# EAGLE design FM-Radio_180828 (EAGLE 7.7.0)

## Sheet 1 of 2
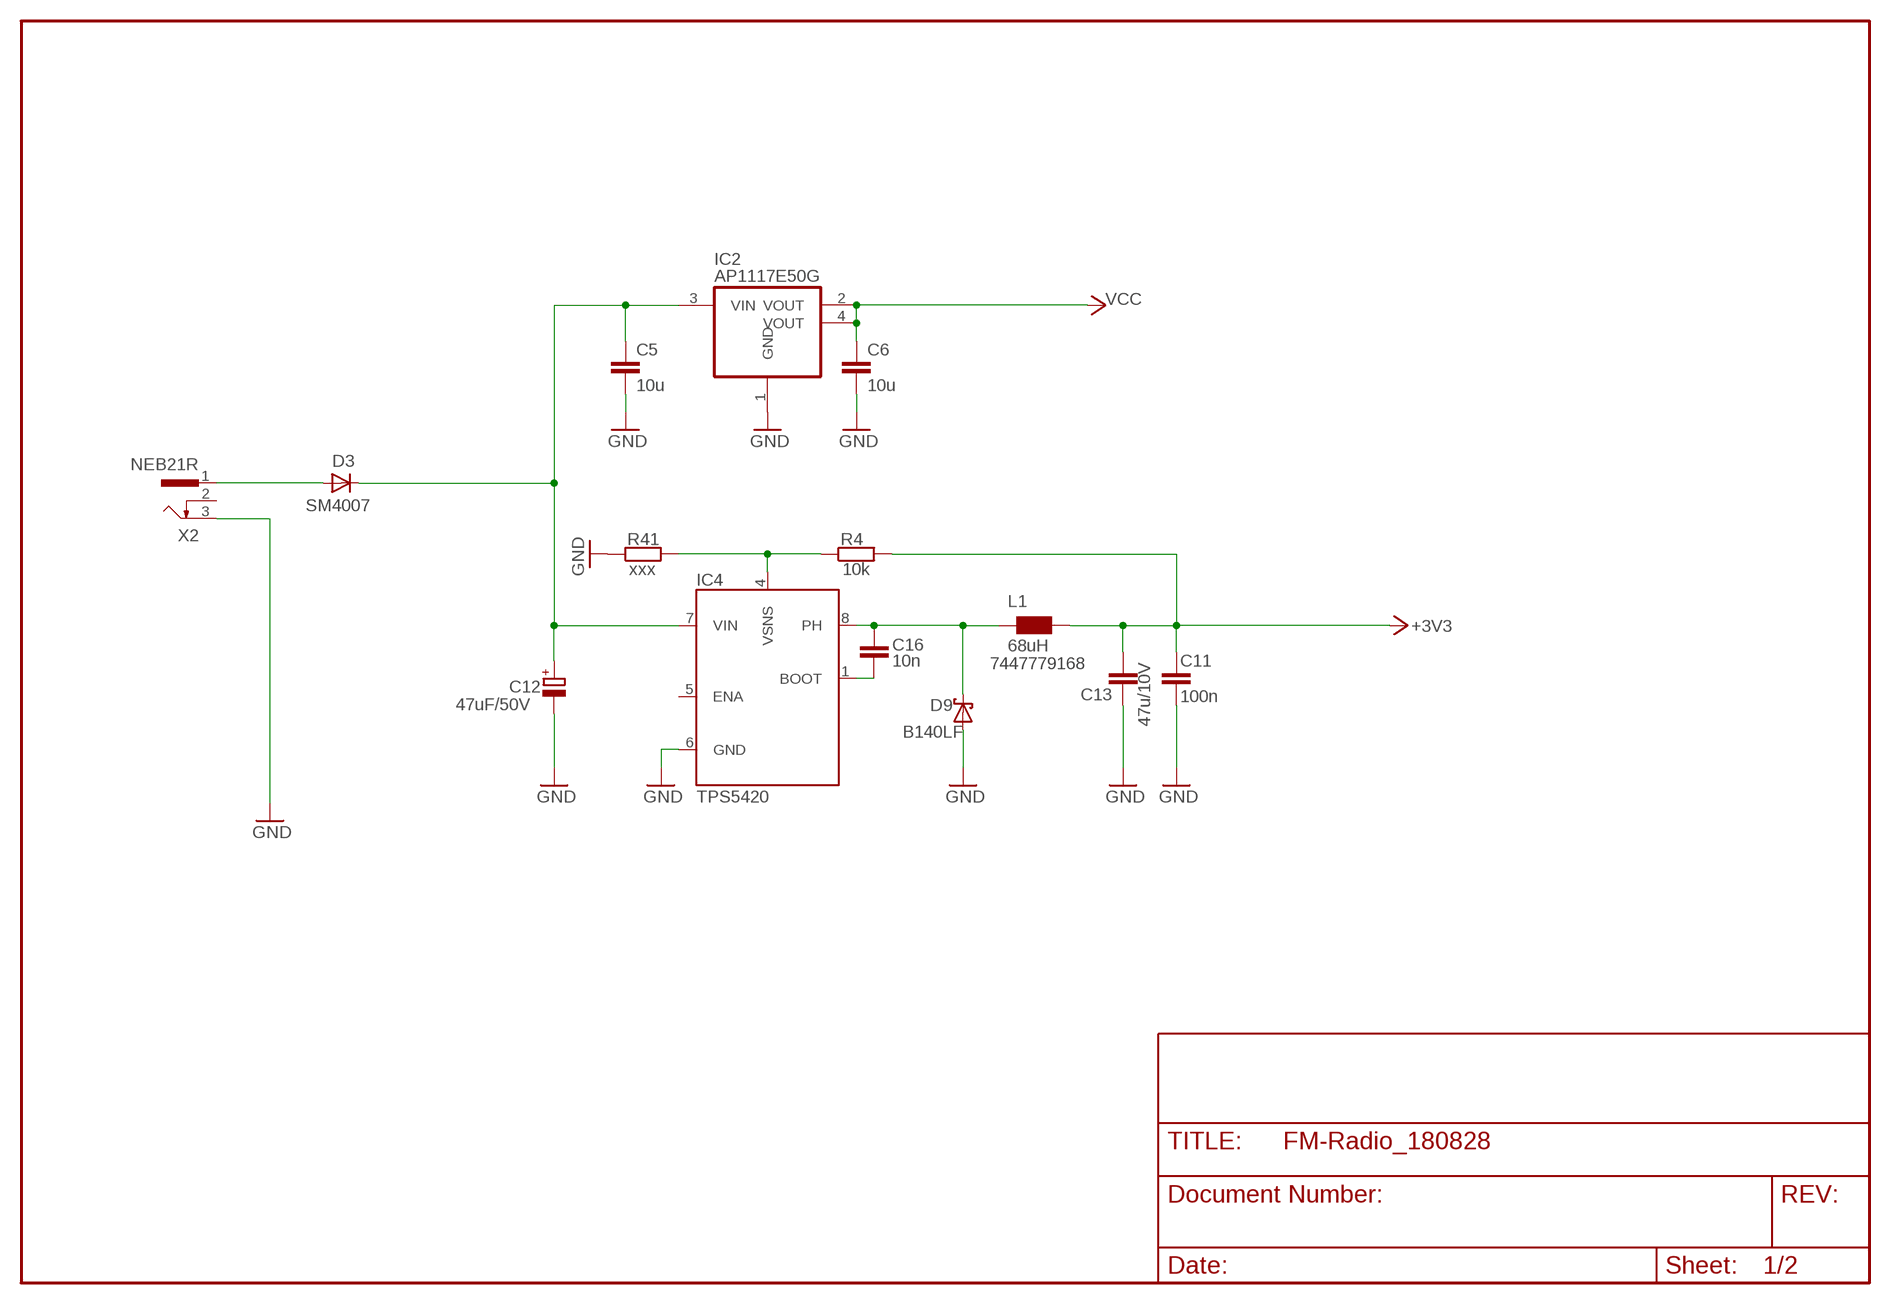
[diagram p0: schematic, sheet 1]

### Parts
C5  10u  C-EUC0805  [C0805]
C6  10u  C-EUC0805  [C0805]
C11  100n  C-EUC0805  [C0805]
C12  47uF/50V  CPOL-EUD  [PANASONIC_D]
C13  47u/10V  C-EUC1210  [C1210]
C16  10n  C-EUC0805  [C0805]
D3  SM4007  DIODE_MELF  [MELF]
D9  B140LF  SCHOTTKY_CD1607  [CD1607]
IC2  AP1117E50G  REG1117-2OUT  [SOT223]
IC4  TPS5420  TPS5410  [SO8]
L1  68uH  WE-PD_S/M  [WE-PD_S/M]
R4  10k  R-EU_R0805  [R0805]
R41  xxx  R-EU_R0805  [R0805]
X2  NEB21R  [NEB21R]

### Nets
+3V3: C11.1 C13.1 L1.1 R4.2 ; also sheet 2
+9V: C5.1 C12.+ D3.C IC2.3(VIN) IC4.7(VIN) ; also sheet 2
GND: C5.2 C6.2 C11.2 C12.- C13.2 D9.A IC2.1(GND) IC4.6(GND) R41.1 X2.3 ; also sheet 2
N$9: D3.A X2.1
N$30: IC4.4(VSNS) R4.1 R41.2
N$32: C16.1 IC4.1(BOOT)
N$33: C16.2 D9.C IC4.8(PH) L1.2
VCC: C6.1 IC2.2(VOUT) IC2.4(VOUT) ; also sheet 2
Unconnected: IC4.5(ENA) X2.2

### Notes on the sheet
- 7447779168

## Sheet 2 of 2
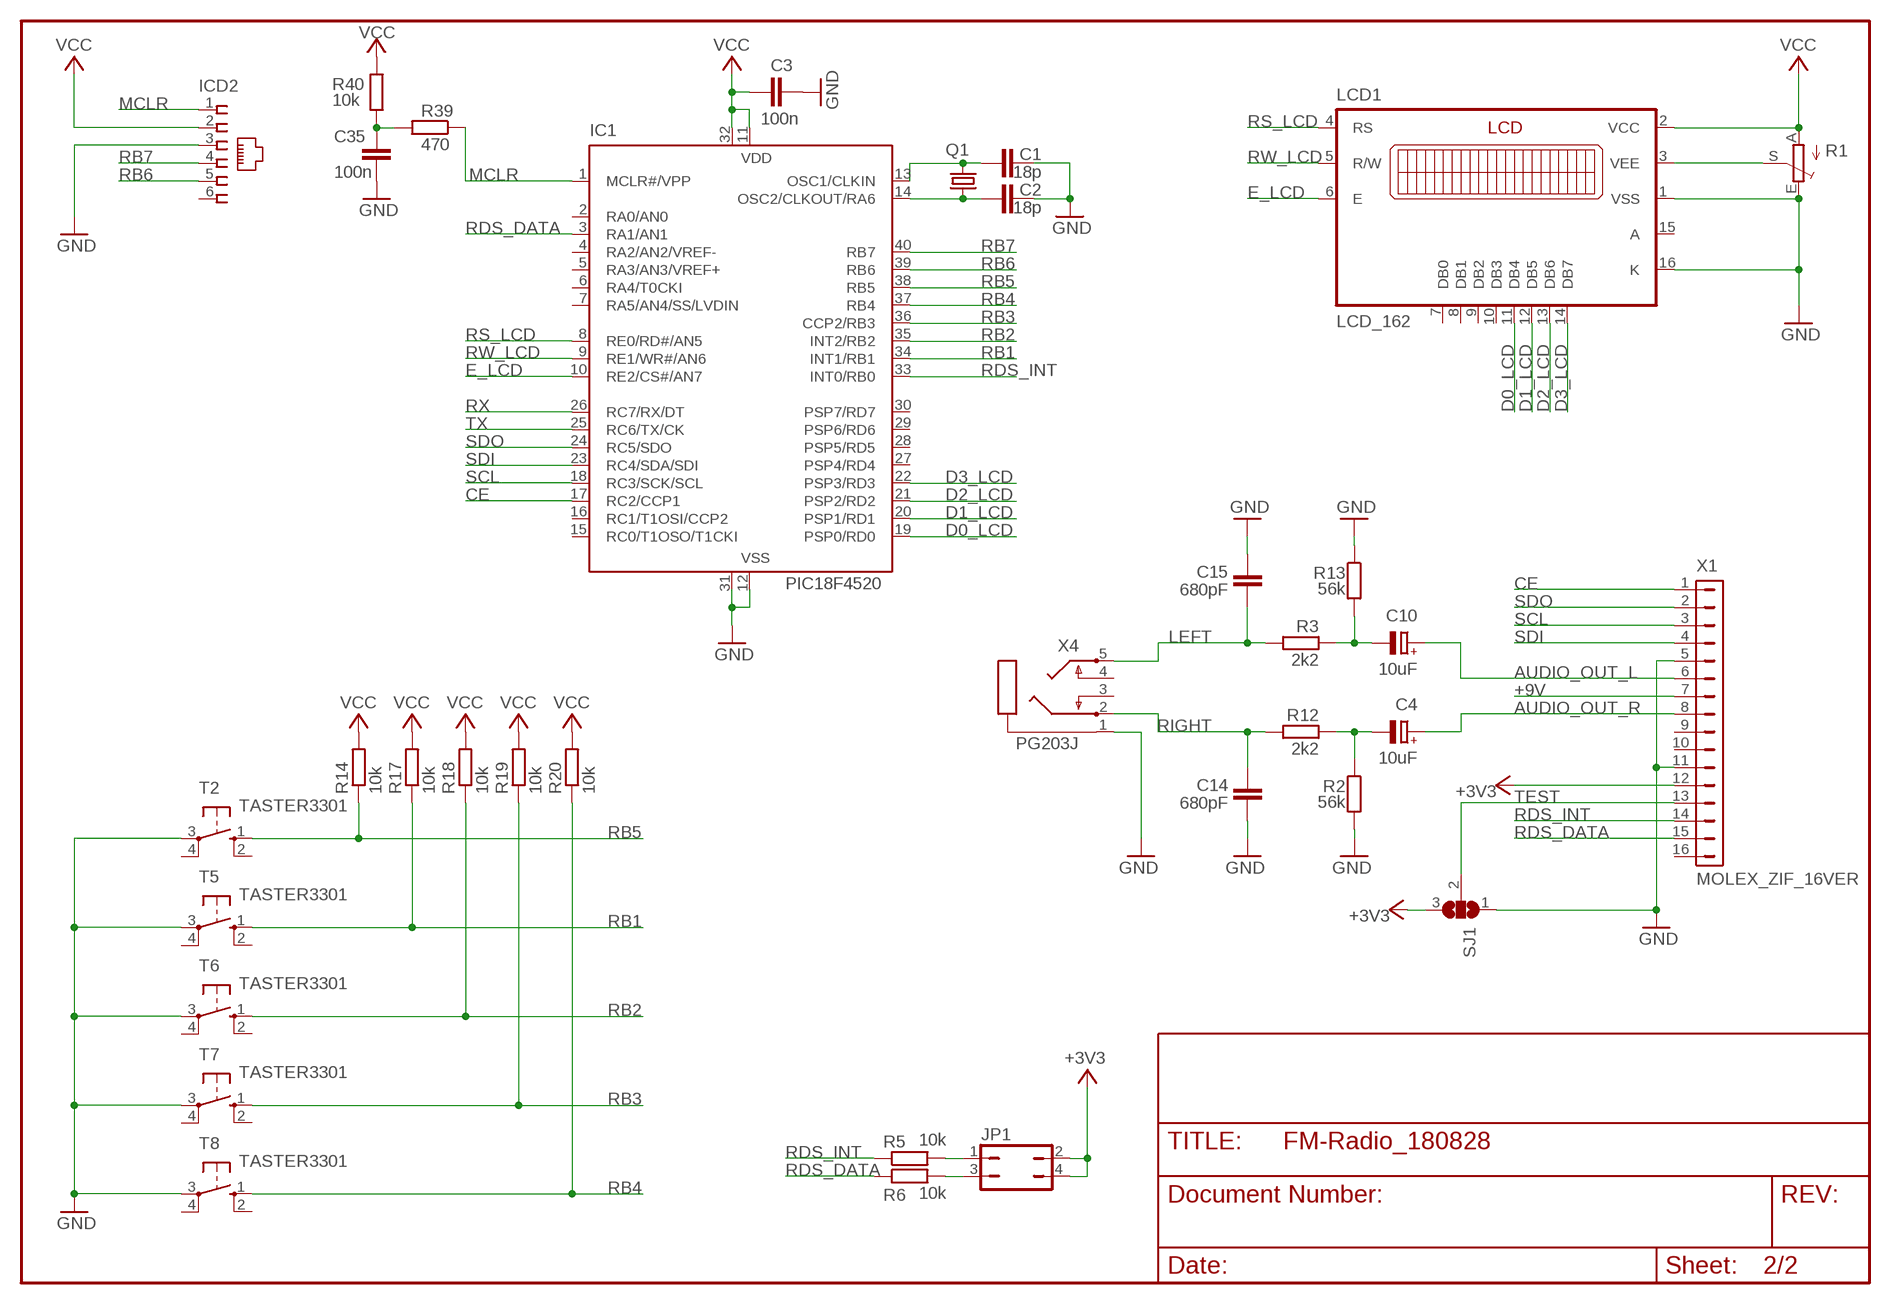
[diagram p1: schematic, sheet 2]

### Parts
C1  18p  C-EUC0805  [C0805]
C2  18p  C-EUC0805  [C0805]
C3  100n  C-EUC0805  [C0805]
C4  10uF  CPOL-EUTT2D4  [TT2D4]
C10  10uF  CPOL-EUTT2D4  [TT2D4]
C14  680pF  C-EU025-025X050  [C025-025X050]
C15  680pF  C-EU025-025X050  [C025-025X050]
C35  100n  C-EUC0805  [C0805]
IC1  PIC18F4520  PIC18C4X2  [DIL40]
ICD2  520250-3  [520250-3]
JP1  JP2Q  [JP2Q]
LCD1  LCD_162  [LCD_162]
Q1  CRYTALHC49U-V  [HC49U-V]
R1  TRIM_EU-LI10  [LI10]
R2  56k  R-EU_0207/7  [0207/7]
R3  2k2  R-EU_0207/7  [0207/7]
R5  10k  R-EU_M0805  [M0805]
R6  10k  R-EU_M0805  [M0805]
R12  2k2  R-EU_0207/7  [0207/7]
R13  56k  R-EU_0207/7  [0207/7]
R14  10k  R-EU_0207/7  [0207/7]
R17  10k  R-EU_0207/7  [0207/7]
R18  10k  R-EU_0207/7  [0207/7]
R19  10k  R-EU_0207/7  [0207/7]
R20  10k  R-EU_0207/7  [0207/7]
R39  470  R-EU_M0805  [M0805]
R40  10k  R-EU_M0805  [M0805]
SJ1  SJ2W  [SJ_2]
T2  TASTER3301  [TASTER3301]
T5  TASTER3301  [TASTER3301]
T6  TASTER3301  [TASTER3301]
T7  TASTER3301  [TASTER3301]
T8  TASTER3301  [TASTER3301]
X1  MOLEX_ZIF_16VER  [ZIF_16POL]
X4  PG203J  [PG203J]

### Nets
+3V3: JP1.2 JP1.4 SJ1.3 X1.12 ; also sheet 1
+9V: X1.7 ; also sheet 1
AUDIO_OUT_L: C10.+ X1.6
AUDIO_OUT_R: C4.+ X1.8
CE: IC1.17(RC2/CCP1) X1.1
D0_LCD: IC1.19(PSP0/RD0) LCD1.11(DB4)
D1_LCD: IC1.20(PSP1/RD1) LCD1.12(DB5)
D2_LCD: IC1.21(PSP2/RD2) LCD1.13(DB6)
D3_LCD: IC1.22(PSP3/RD3) LCD1.14(DB7)
E_LCD: IC1.10(RE2/CS#/AN7) LCD1.6(E)
GND: C1.2 C2.2 C3.2 C14.1 C15.2 C35.2 IC1.12(VSS) IC1.31(VSS) ICD2.3 LCD1.1(VSS) LCD1.16(K) R1.E R2.2 R13.1 SJ1.1 T2.3(P) T5.3(P) T6.3(P) T7.3(P) T8.3(P) X1.5 X1.11 X4.1 ; also sheet 1
LEFT: C15.1 R3.1 X4.5
MCLR: IC1.1(MCLR#/VPP) ICD2.1 R39.1
N$1: C10.- R3.2 R13.2
N$2: JP1.1 R5.2
N$3: JP1.3 R6.2
N$4: C2.1 IC1.14(OSC2/CLKOUT/RA6) Q1.1
N$5: C1.1 IC1.13(OSC1/CLKIN) Q1.2
N$6: LCD1.3(VEE) R1.S
N$7: C4.- R2.1 R12.2
N$47: C35.1 R39.2 R40.2
RB1: IC1.34(INT1/RB1) R17.1 T5.1(S)
RB2: IC1.35(INT2/RB2) R18.1 T6.1(S)
RB3: IC1.36(CCP2/RB3) R19.1 T7.1(S)
RB4: IC1.37(RB4) R20.1 T8.1(S)
RB5: IC1.38(RB5) R14.1 T2.1(S)
RB6: IC1.39(RB6) ICD2.5
RB7: IC1.40(RB7) ICD2.4
RDS_DATA: IC1.3(RA1/AN1) R6.1 X1.15
RDS_INT: IC1.33(INT0/RB0) R5.1 X1.14
RIGHT: C14.2 R12.1 X4.2
RS_LCD: IC1.8(RE0/RD#/AN5) LCD1.4(RS)
RW_LCD: IC1.9(RE1/WR#/AN6) LCD1.5(R/W)
RX: IC1.26(RC7/RX/DT)
SCL: IC1.18(RC3/SCK/SCL) X1.3
SDI: IC1.23(RC4/SDA/SDI) X1.4
SDO: IC1.24(RC5/SDO) X1.2
TEST: SJ1.2 X1.13
TX: IC1.25(RC6/TX/CK)
VCC: C3.1 IC1.11(VDD) IC1.32(VDD) ICD2.2 LCD1.2(VCC) R1.A R14.2 R17.2 R18.2 R19.2 R20.2 R40.1 ; also sheet 1
Unconnected: IC1.2(RA0/AN0) IC1.4(RA2/AN2/VREF-) IC1.5(RA3/AN3/VREF+) IC1.6(RA4/T0CKI) IC1.7(RA5/AN4/SS/LVDIN) IC1.15(RC0/T1OSO/T1CKI) IC1.16(RC1/T1OSI/CCP2) IC1.27(PSP4/RD4) IC1.28(PSP5/RD5) IC1.29(PSP6/RD6) IC1.30(PSP7/RD7) ICD2.6 LCD1.7(DB0) LCD1.8(DB1) LCD1.9(DB2) LCD1.10(DB3) LCD1.15(A) T2.2(S1) T2.4(P1) T5.2(S1) T5.4(P1) T6.2(S1) T6.4(P1) T7.2(S1) T7.4(P1) T8.2(S1) T8.4(P1) X1.9 X1.10 X1.16 X4.3 X4.4

## Library data of the parts
C1-C3 C5 C6 C13-C15 C35 = rcl:C-EU: CAPACITOR, European symbol
C4 C10 = rcl:CPOL-EU: POLARIZED CAPACITOR, European symbol
C11 C16 = rcl_416:C-EU: CAPACITOR, European symbol
C12 = rcl_416:CPOL-EU: POLARIZED CAPACITOR, European symbol
D3 = Bernd:DIODE
D9 = Bernd:SCHOTTKY
IC1 = Bernd:PIC18C4X2
IC2 = Bernd_110428:REG1117-2OUT: 800mA and 1A Low Dropout (LDO) Positive Regulator 1.8V, 2.5V, 2.85V, 3.3V, 5V, and Adj
IC4 = Bernd:TPS5410
ICD2 = con-amp:520250-3: AMP connector
JP1 = jumper:JP2Q: JUMPER
L1 = wuerth-elektronik:WE-PD: SMD-Shielded Power Inductors WE-PD Is recommended for the application with switching regulators from National Semiconductor, Linear Technology, Texas Instruments and Fairchild Semiconductor - Magnetically shielded version which results in a low leakage field - High storage capacity - Low self-losses -- Switching regulators with low operating voltages (computer, laptop, mobile phones, pagers) -- Integrated DC/DC-converter
LCD1 = Bernd:LCD_162
Q1 = crystal:CRYTAL: CRYSTAL
R1 = pot:TRIM_EU-: POTENTIOMETER
R2-R4 R12-R14 R17-R20 R39-R41 = rcl:R-EU_: RESISTOR, European symbol
R5 R6 = rcl_416:R-EU_: RESISTOR, European symbol
SJ1 = jumper:SJ2W: SMD solder JUMPER
T2 T5-T8 = Bernd:TASTER3301
X1 = Bernd:MOLEX_ZIF_16
X2 = con-lumberg:NEB21R: Netzgeräte-Einbaukupplung abgewinkelte Ausführung mit Öffner Source: http://www.lumberg.com/Produkte/PDFs/NEB21R.pdf; FARNELL: 1217037; MPN: NEB 21 R; OC_FARNELL: 1217037; OC_NEWARK: 97K6458
X4 = con-hirschmann:PG203J: MIC/HEADPHONE JACK KS-S stereo microphone/headphone jack PG203JN (Schukat)

## Board
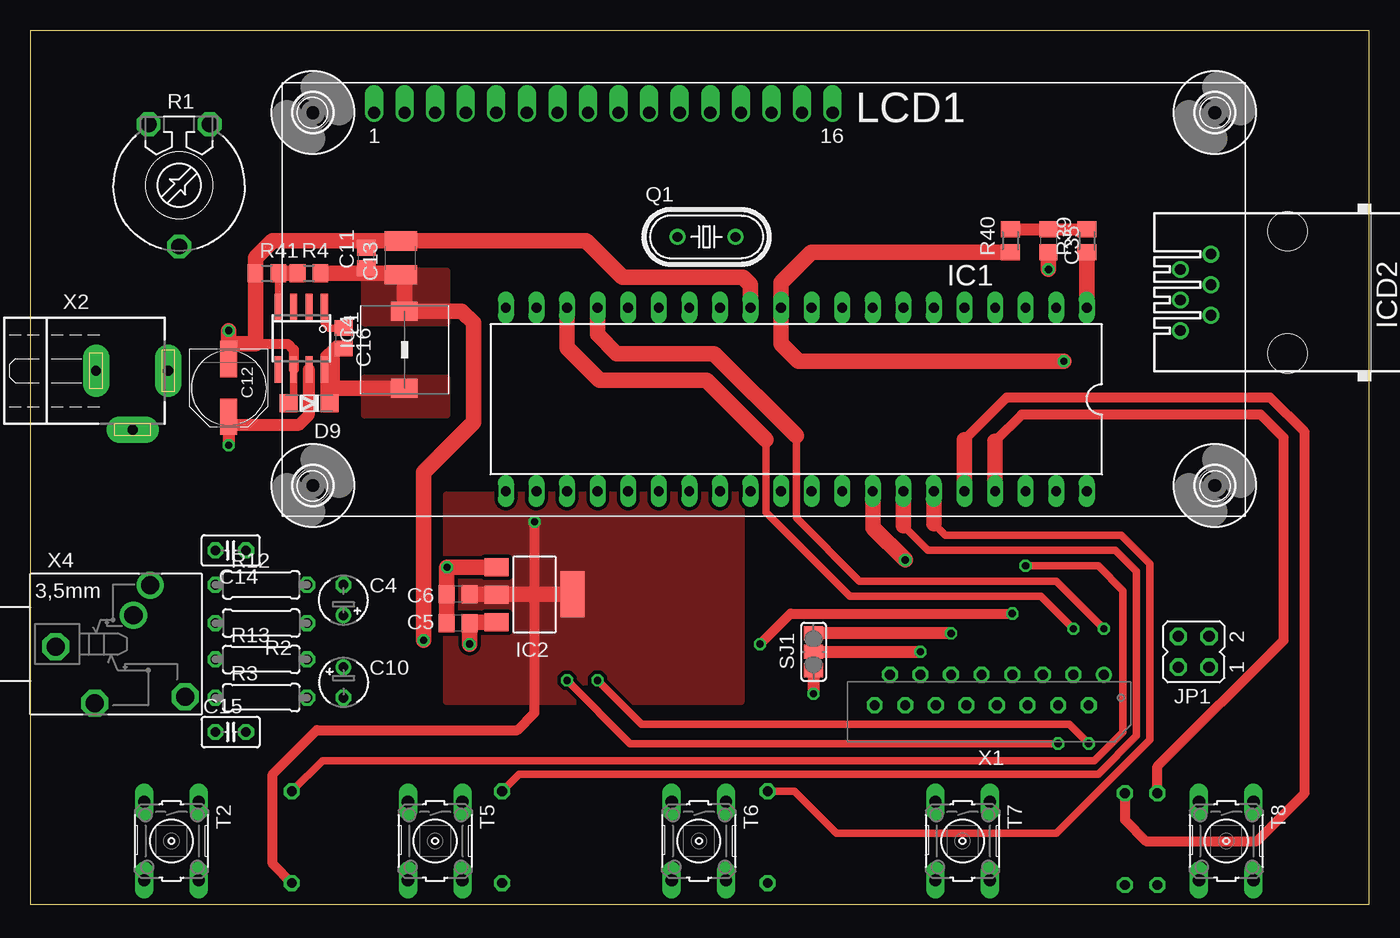
[diagram p2: board, top side]
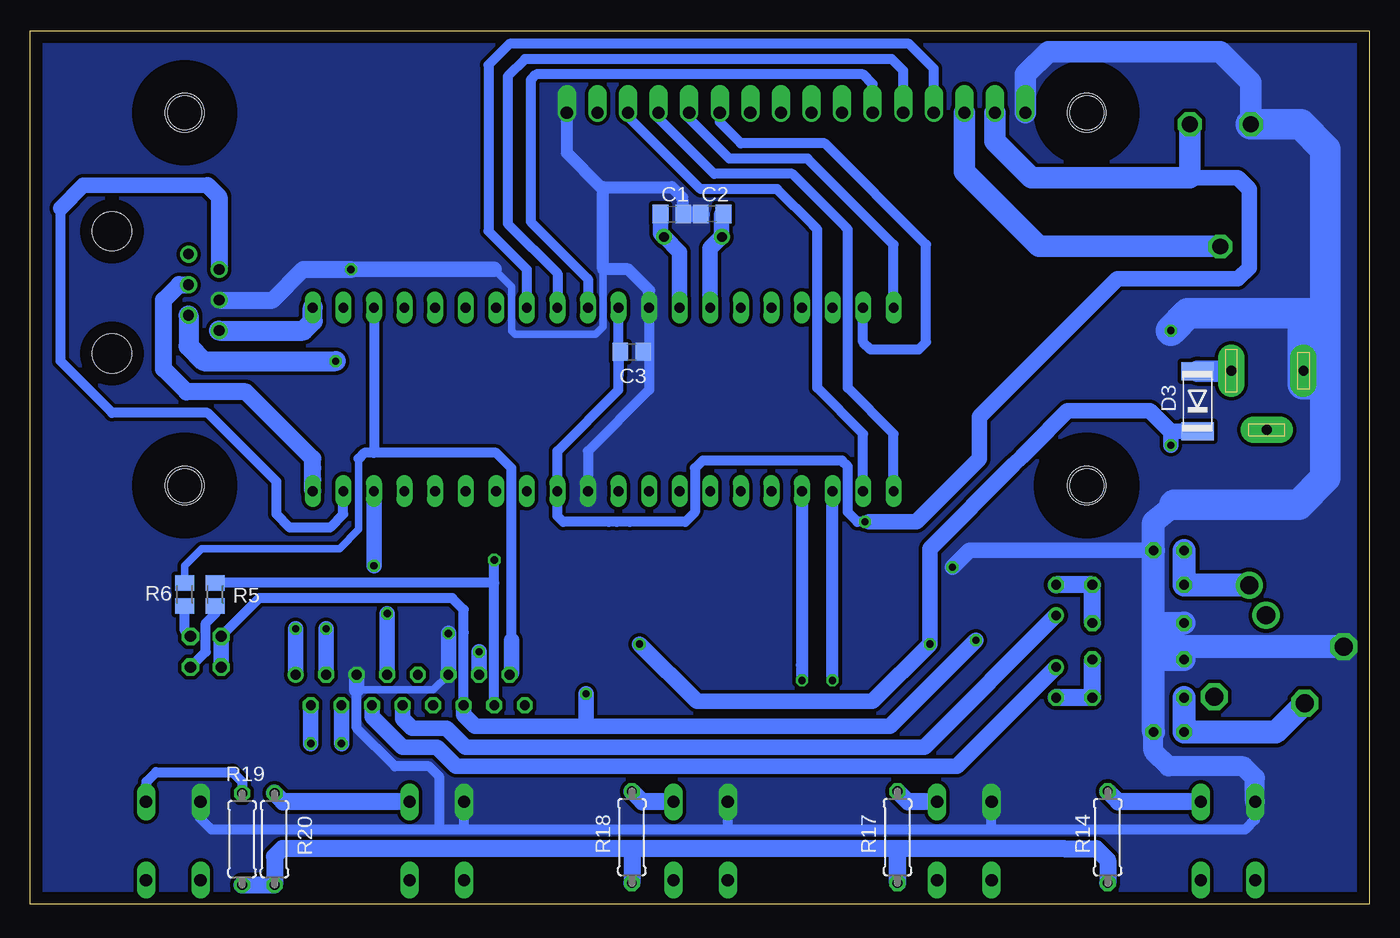
[diagram p3: board, bottom side, seen from below]

Size 111.26 x 72.54 mm. Coordinates in mm from the lower left corner, seen from the top.
Outline: 0,0 111.26,0 111.26,72.54 0,72.54 0,0
Copper layers (1*16): Top 0.035mm / dielectric 1.5mm / Bottom 0.035mm
Design rules "default": minimum track width 10mil, minimum drill 24mil, track to track 8mil, track to pad 8mil, pad to pad 8mil, via to via 8mil, smd to smd 8mil, copper to edge 40mil, drill to drill 8mil, minimum pad ring 10mil, minimum via ring 8mil, stop-mask expansion 4mil, vias tented up to drill 0mil, thermal gap 10mil

### Footprints (pad centres in the part's own frame; a part is rotated, then mirrored left to right if it is on the bottom)
C0805 = smd 1.3 x 1.5: 1 -0.95,0; 2 0.95,0
TT2D4 = drill 0.813: + -1.27,0 | drill 0.813 octagon: - 1.27,0
C0805' = smd 1.3 x 1.5: 1 -0.85,0; 2 0.85,0
PANASONIC_D = smd 3 x 1.4: + 2.4,0; - -2.4,0
C1210 = smd 1.6 x 2.7: 1 -1.4,0; 2 1.4,0
C025-025X050 = drill 0.813 octagon: 1 -1.27,0; 2 1.27,0
MELF = smd 1.5 x 2.7: A 2.5,0; C -2.5,0
CD1607 = smd 1.5 x 1.5: A 1.7,0; C -1.7,0
DIL40 = drill 0.813 long: 1 -24.13,-7.62; 2 -21.59,-7.62; 3 -19.05,-7.62; 4 -16.51,-7.62; 5 -13.97,-7.62; 6 -11.43,-7.62; 7 -8.89,-7.62; 8 -6.35,-7.62; 9 -3.81,-7.62; 10 -1.27,-7.62; 11 1.27,-7.62; 12 3.81,-7.62; 13 6.35,-7.62; 14 8.89,-7.62; 15 11.43,-7.62; 16 13.97,-7.62; 17 16.51,-7.62; 18 19.05,-7.62; 19 21.59,-7.62; 20 24.13,-7.62; 21 24.13,7.62; 22 21.59,7.62; 23 19.05,7.62; 24 16.51,7.62; 25 13.97,7.62; 26 11.43,7.62; 27 8.89,7.62; 28 6.35,7.62; 29 3.81,7.62; 30 1.27,7.62; 31 -1.27,7.62; 32 -3.81,7.62; 33 -6.35,7.62; 34 -8.89,7.62; 35 -11.43,7.62; 36 -13.97,7.62; 37 -16.51,7.62; 38 -19.05,7.62; 39 -21.59,7.62; 40 -24.13,7.62
SOT223 = smd 1.499 x 2.007: 1 -2.261,-3.15; 2 0.025,-3.15; 3 2.311,-3.15 | smd 3.81 x 2.007: 4 0,3.15
SO8 = smd 0.6 x 2.2: 1 -1.905,-2.6; 2 -0.635,-2.6; 3 0.635,-2.6; 4 1.905,-2.6; 5 1.905,2.6; 6 0.635,2.6; 7 -0.635,2.6; 8 -1.905,2.6
520250-3 = drill 0.889: 1 -3.175,8.89; 2 -1.905,6.35; 3 -0.635,8.89; 4 0.635,6.35; 5 1.905,8.89; 6 3.175,6.35 | hole 3.251: -5.08,0; 5.08,0
JP2Q = drill 0.914 octagon: 1 -1.27,-1.27; 2 -1.27,1.27; 3 1.27,-1.27; 4 1.27,1.27
WE-PD_S/M = smd 1.6 x 2.2: 1 -3.2,0; 2 3.2,0
LCD_162 = drill 1.016 offset: 1 -31.75,15.24; 2 -29.21,15.24; 3 -26.67,15.24; 4 -24.13,15.24; 5 -21.59,15.24; 6 -19.05,15.24; 7 -16.51,15.24; 8 -13.97,15.24; 9 -11.43,15.24; 10 -8.89,15.24; 11 -6.35,15.24; 12 -3.81,15.24; 13 -1.27,15.24; 14 1.27,15.24; 15 3.81,15.24; 16 6.35,15.24 | hole 2.8: -36.83,15.24; 38.1,15.24; 38.1,-15.748; -36.83,-15.748
HC49U-V = drill 0.813: 1 -2.413,0; 2 2.413,0
LI10 = drill 1.321 octagon: A -2.54,-5.08; E 2.54,-5.08; S 0,5.08
0207/7 = drill 0.813 octagon: 1 -3.81,0; 2 3.81,0
R0805 = smd 1.3 x 1.5: 1 -0.95,0; 2 0.95,0
M0805 = smd 1.3 x 1.6: 1 -0.95,0; 2 0.95,0
SJ_2 = smd 1.168 x 1.6: 1 -1.524,0; 2 0,0; 3 1.524,0
TASTER3301 = drill 1.016 long: 1 -3.251,2.261; 2 3.251,2.261; 3 -3.251,-2.261; 4 3.251,-2.261
3,2 = hole 3.2: 0,0
ZIF_16POL = drill 0.813: 1 0,0 | drill 0.813 octagon: 2 1.27,2.54; 3 2.54,0; 4 3.81,2.54; 5 5.08,0; 6 6.35,2.54; 7 7.62,0; 8 8.89,2.54; 9 10.16,0; 10 11.43,2.54; 11 12.7,0; 12 13.97,2.54; 13 15.24,0; 14 16.51,2.54; 15 17.78,0; 16 19.05,2.54
NEB21R = drill 0.813 pad 2.184 long: 1 0,7.35; 2 4.9,4.4; 3 0,1.35
PG203J = drill 1.499 octagon: 1 -5.004,-0.203; 4 5.74,-4.369; 5 -1.753,-4.902 | drill 1.499: 2 2.845,4.902; 3 1.448,2.388

### Placement (x,y rotation side)
C1  57.94,57.3 0 bottom
C2  54.61,57.3 180 bottom
C3  61.27,45.87 0 bottom
C4  26.03,25.24 90 top
C5  35.55,23.33 180 top
C6  35.55,25.71 180 top
C10  26.03,18.41 270 top
C11  100n  [C0805']  27.94,53.65 90 top
C12  16.51,42.86 270 top
C13  30.79,53.65 90 top
C14  16.66,29.36 180 top
C15  16.66,14.28 0 top
C16  10n  [C0805']  26.03,46.98 270 top
C35  84.61,55.08 270 top
D3  14.28,41.75 90 bottom
D9  23.17,41.59 180 top
IC1  63.65,41.9 180 top
IC2  41.9,25.71 270 top
IC4  22.54,46.98 180 top
ICD2  104.45,50.79 90 top
JP1  96.67,20.95 90 top
L1  31.11,46.03 270 top
LCD1  60.32,50.48 0 top
Q1  56.19,55.4 0 top
R1  12.38,59.68 180 top
R2  19.2,23.33 180 top
R3  19.2,17.14 0 top
R4  23.17,52.38 0 top
R5  95.88,25.71 270 bottom
R6  98.42,25.71 270 bottom
R12  19.2,26.5 0 top
R13  19.2,20.31 0 top
R14  21.74,5.55 270 bottom
R17  39.21,5.55 270 bottom
R18  61.27,5.55 270 bottom
R19  90.96,5.39 270 bottom
R20  93.66,5.39 270 bottom
R39  87.78,55.08 90 top
R40  81.43,55.08 90 top
R41  19.68,52.38 0 top
SJ1  65.08,20.95 270 top
T2  11.74,5.23 270 top
T5  33.65,5.23 270 top
T6  55.56,5.23 270 top
T7  77.47,5.23 270 top
T8  99.37,5.23 270 top
U$3  [3,2]  23.49,65.72 0 top
U$4  [3,2]  98.42,65.72 0 top
U$5  [3,2]  98.42,34.76 0 top
U$7  [3,2]  23.49,34.76 0 top
X1  89.21,19.04 180 top
X2  4.12,44.29 270 top
X4  7.14,21.58 0 top

### Tracks (layer width: path | path; a pad name or v marks a point on that pad's centre or on a via)
+3V3  (via drill 0.6)
  Top 1.016: SJ1.3 v65.08,17.46
  Top 1.27: R4.2 27.94,52.38 | 27.94,52.38 31.11,52.38 31.11,51.93 | 31.11,51.93 L1.1 35.85,49.23 36.82,48.25 36.82,40 32.7,35.87 v32.7,21.9 | C13.1 31.11,51.93 | C11.1 27.94,52.38
  Bottom 0.813: X1.12 75.24,22.54 75.24,24.44 76.2,25.39 77.15,25.39 92.23,25.39 94.77,22.85 JP1.4 | JP1.4 | X1.12 | X1.12
  Bottom 1.27: JP1.4 JP1.2 | v32.7,21.9 39.84,14.76 65.08,14.76 | 65.08,14.76 74.29,14.76 75.24,15.71 X1.12 | v65.08,17.46 65.08,14.76
  pour Top (isolate 0.406, no thermals): 27.78,52.54 34.6,52.54 34.6,48.25 27.78,48.25
+9V  (via drill 0.6)
  Top 0.813: v81.59,24.12 63.18,24.12 v60.64,21.58
  Top 1.016: 16.51,39.82 22.36,39.82 23.17,40.63 IC4.7 | C12.+ 16.51,39.82 | 16.51,39.82 16.51,38.25 v16.51,38.09
  Top 1.27: IC2.3 36.5,23.4 C5.1 v36.5,21.59 v36.51,21.58
  Bottom 1.27: 20.47,40.95 18.25,40.95 | 18.25,40.95 25.08,40.95 28.25,37.78 28.89,37.14 29.52,36.51 36.51,29.52 v36.51,21.58 41.27,16.82 55.88,16.82 v60.64,21.58 | X1.7 81.59,21.74 v81.59,24.12 | D3.C 16.51,39.24 | 16.51,39.24 16.55,39.24 18.25,40.95 | v16.51,38.09 16.51,39.24
AUDIO_OUT_L
  Bottom 1.27: X1.6 82.86,15.55 80.32,13.01 77.47,13.01 75.88,11.42 34.28,11.42 C10.+ | C10.+
AUDIO_OUT_R
  Bottom 1.27: X1.8 80.32,15.39 79.53,14.6 76.67,14.6 75.08,13.01 36.98,13.01 C4.+
CE  (via drill 0.6)
  Top 0.61: v89.21,22.85 88.58,23.49 85.24,26.82 68.89,26.82 63.65,32.06 63.65,38.89
  Top 0.813: IC1.17
  Top 1.27: 63.65,38.89 56.83,45.71 48.73,45.71 47.14,47.3 IC1.17
  Bottom 1.27: X1.1 89.21,21.27 v89.21,22.85
D0_LCD
  Bottom 0.813: LCD1.11 53.97,64.92 52.22,63.18 45.24,63.18 36.82,54.76 36.82,46.67 37.46,46.03 41.43,46.03 42.06,46.67 IC1.19 | IC1.19
D1_LCD
  Bottom 0.813: LCD1.12 56.51,65.24 53.18,61.91 46.67,61.91 39.52,54.76 39.52,49.84 | 39.52,49.84 | IC1.20 39.52,49.84
D2_LCD
  Bottom 0.813: LCD1.13 59.05,65.24 54.45,60.64 47.94,60.64 43.49,56.19 | 43.49,56.19 | 43.49,56.19 43.33,56.03 43.33,42.86 39.52,39.05 IC1.21 | IC1.21
D3_LCD
  Bottom 0.813: LCD1.14 61.59,65.4 55.56,59.37 49.21,59.37 46.19,56.35 | 46.19,56.35 | 46.03,56.19 46.19,56.35 | 46.03,56.19 | 46.03,56.19 45.87,56.03 45.87,42.86 42.06,39.05 IC1.22 | IC1.22
E_LCD
  Bottom 0.813: LCD1.6 41.27,68.1 42.06,68.89 69.21,68.89 69.69,68.41 69.69,56.67 65.08,52.06 | 65.08,52.06 | 65.08,52.06 64.92,51.9 64.92,49.68 | 64.92,49.68 | 64.92,49.68 IC1.10
GND  (via drill 0.6)
  Top 0.61: IC4.6 21.9,41.59 D9.A
  Top 0.813: IC4.6 21.9,46.03 21.43,46.51 16.51,46.51 C12.-
  Top 1.016: v76.51,22.47 SJ1.1
  Top 1.27: 59.84,51.43 59.21,52.06 49.21,52.06 46.19,55.08 30.79,55.08 | 27.94,55.08 20.16,55.08 18.73,53.65 R41.1 18.73,46.51 16.66,46.51 | 27.94,55.08 30.79,55.08 | C35.2 v84.61,52.7 | C5.2 C6.2 34.6,27.94 v34.64,27.97 IC2.1 | 16.51,46.51 v16.51,47.62 | C11.2 27.94,55.08 | C13.2 30.79,55.08 | 59.84,51.43 | 59.84,51.43 IC1.12
  Bottom 0.61: 72.7,52.7 71.27,51.27 71.27,47.62 70.96,47.3 64.29,47.3 63.65,47.94 63.65,52.7 | X1.11 77.78,17.77 84.13,17.77
  Bottom 0.813: IC1.12 | 60.48,45.87 C3.2 59.84,45.87 | 59.84,45.87 59.84,42.7 64.92,37.62 64.92,34.44 | 64.92,34.44 | 64.92,34.44 IC1.31 | LCD1.16 | LCD1.16 | 31.43,6.18 10.31,6.18 9.52,6.98 9.52,8.41 9.48,8.45 T2.3 | 31.43,6.18 53.34,6.18 | 53.34,6.18 75.24,6.18 | 75.24,6.18 77.31,6.18 | 77.31,6.18 96.2,6.18 97.15,7.14 97.15,8.57 97.11,8.53 T8.3 | T5.3 31.39,6.22 31.43,6.18 | T6.3 53.3,6.22 53.34,6.18 | 75.24,6.18 75.2,6.22 T7.3 75.24,8.52 75.24,8.57 | X1.11 | X1.5 | X1.5 | 84.13,17.77 84.13,14.6 80.96,11.42 78.1,11.42 77.31,10.63 77.31,6.18 | IC1.12 59.84,45.87
  Bottom 1.016: IC1.12 59.84,50.95 61.59,52.7 63.65,52.7 63.65,52.86 63.65,59.52 63.81,59.52 | 63.81,59.52 66.67,62.38 LCD1.16 | C1.2 57.09,58.67 57.94,59.52 63.81,59.52
  Bottom 1.27: C2.2 55.45,57.3 C1.2 | 72.7,52.7 v84.61,52.7 87.94,52.7 | C14.1 33.25,29.36 v34.64,27.97 | 84.13,17.77 X1.5 | X1.11 v76.51,22.47
  Bottom 1.422: 18.25,29.36 | C14.1 18.25,29.36 | ICD2.3 91.12,50.16 88.58,52.7 v84.61,52.7
  Bottom 1.676: C15.2 17.93,12.69 16.66,11.42 10.47,11.42 9.52,10.47 9.52,8.57 9.48,8.53 T2.3
  Bottom 1.778: LCD1.1 28.57,68.89 26.67,70.8 17.78,70.8 12.38,70.8 9.84,68.26 R1.E
  Bottom 1.93: C15.2 | C15.2 17.93,20.31 | 17.93,20.31 17.93,23.33 | 17.93,23.33 C14.1 | C14.1 | R2.2 | 17.93,23.33 R2.2 | R13.1 | 17.93,20.31 R13.1 | X4.1 2.18,21.42 17.3,21.42 16.51,20.63 15.55,20.63 15.55,20.47 R13.1 | C14.1 17.93,31.74 16.19,33.17
  Bottom 2.54: 7.93,49.05 10.47,49.05 | 16.19,33.17 5.87,33.17 3.65,35.39 3.65,44.28 | 3.65,49.05 3.65,62.7 5.71,64.76 R1.E | 5.55,49.05 7.93,49.05 | v16.51,47.62 15.08,49.05 12.22,49.05 7.93,49.05 | 4.28,49.05 | 3.65,49.05 4.28,49.05 | 3.65,44.28 X2.3 | 3.65,44.28 3.65,49.05 | 4.28,49.05 5.55,49.05 | 5.55,49.05 5.55,43.17 3.96,43.17 3.96,45.71
  pour Bottom (isolate 0.305, no thermals): -0.01,-0.01 111.12,-0.01 111.12,72.38 -0.01,72.38
LEFT
  Bottom 1.93: X4.5 7.79,14.28 C15.1 | C15.1 | C15.1 | R3.1 | C15.1 R3.1
MCLR
  Top 1.016: IC1.1
  Top 1.27: IC1.1 R39.1
  Bottom 1.676: ICD2.1 88.58,47.62 87.78,48.41 IC1.1
N$1
  Bottom 1.422: R3.2 R13.2 | R3.2 | R3.2 | R3.2 C10.- | R3.2
N$2
  Bottom 0.813: R5.2 95.88,24.12 96.67,23.33 96.67,20.95 JP1.1 | JP1.1
N$3
  Bottom 0.813: JP1.3 | R6.2 98.42,22.69 JP1.3
N$4
  Bottom 1.27: C2.1 53.81,57.25 53.81,55.4 | 53.81,55.4 Q1.1 | IC1.14 54.76,54.44 53.81,55.4
N$5
  Bottom 1.27: C1.1 58.89,57.2 58.89,55.68 Q1.2 58.57,55.4 57.3,54.13 IC1.13
N$6
  Bottom 1.778: LCD1.3 33.65,60.79 27.46,54.6 13.33,54.6 R1.S | R1.S
N$7
  Bottom 1.422: R12.2 | R2.1 R12.2 | C4.- | R12.2 C4.- | C4.-
N$9
  Bottom 1.778: D3.A 11.51,44.24 X2.1
N$30
  Top 0.61: IC4.4 20.63,52.7 R41.2
  Top 1.27: R41.2 R4.1
N$32
  Top 0.61: IC4.1 24.44,48.25 24.86,47.83 C16.1
N$33
  Top 0.61: D9.C 24.44,41.59 IC4.8 24.44,45.55 25.08,46.19 25.97,46.19 C16.2
  Top 1.27: L1.2 25.08,42.83 25.08,43.81 | 25.08,43.81 25.08,45.71 25.5,46.13 C16.2 | 25.08,43.81 24.92,43.65 24.92,41.74
  pour Top (isolate 0.406, no thermals): 27.78,43.65 34.6,43.65 34.6,40.63 27.78,40.63
N$47
  Top 1.016: R40.2 C35.1 R39.2
RB1
  Top 0.61: 72.54,31.43 74.61,29.36 90.17,29.36 91.91,27.62 91.91,26.5 91.91,25.55 91.91,13.96 88.74,10.79 40.63,10.79 39.84,9.99 R17.1
  Top 1.27: 72.54,31.43 IC1.34
  Bottom 1.422: R17.1 | T5.1 38.33,8.48 R17.1
RB2
  Top 0.61: 75.08,31.58 76.04,30.63 90.64,30.63 93.02,28.25 93.02,25.71 93.02,13.65 89.21,9.84 85.24,5.87 66.99,5.87 63.49,9.36 R18.1
  Top 1.27: 75.08,31.58 IC1.35
  Bottom 1.422: T6.1 60.4,8.48 R18.1
RB3
  Top 0.813: 77.62,38.57 81.12,42.06 103.02,42.06 105.88,39.2 105.88,9.2 101.91,5.23 92.7,5.23 90.96,6.98 R19.1
  Top 1.27: 77.62,38.57 IC1.36
  Bottom 1.422: T7.1 90.24,8.48 R19.1
RB4
  Top 0.813: 80.16,38.41 82.39,40.63 102.23,40.63 104.14,38.73 104.14,21.9 93.66,11.42 R20.1
  Top 1.27: 80.16,38.41 IC1.37
  Bottom 0.813: T8.1 101.63,9.72 101.59,10.15 100.8,10.95 94.45,10.95 93.66,10.15 R20.1
RB5  (via drill 0.6)
  Top 0.61: v82.7,28.09 88.26,28.09 88.74,28.09 90.8,26.03 90.8,22.85 90.8,19.52 90.8,14.28 88.42,11.9 24.28,11.9 R14.1
  Bottom 1.27: v82.7,28.09 IC1.38
  Bottom 1.422: T2.1 20.87,8.48 R14.1
RB6
  Bottom 0.813: 108.74,57.78 108.74,45.08 104.45,40.79 96.52,40.79 90.8,35.08 90.8,32.38 89.69,31.27 86.36,31.27 85.24,32.38 IC1.39
  Bottom 1.27: 96.52,59.68 106.83,59.68 108.74,57.78 | IC1.39
  Bottom 1.422: ICD2.5 | ICD2.5 95.56,58.73 96.52,59.68
RB7
  Bottom 1.422: ICD2.4 98.9,51.43 100.17,50.16 100.17,44.44 98.26,42.54 93.34,42.54 87.78,36.98 87.78,36.19 87.78,35.24 IC1.40 | IC1.40
RDS_DATA
  Bottom 0.61: 83.97,36.98 83.97,31.11 85.56,29.52 96.99,29.52 98.42,28.09 R6.1 | 82.7,49.84 | IC1.3 82.7,49.84
  Bottom 0.813: 82.7,37.46 72.54,37.46 71.27,36.19 71.27,21.9 | 82.7,37.46 83.5,37.46 83.97,36.98 | IC1.3 82.7,37.46 | X1.15
  Bottom 1.27: 71.27,21.9 71.27,19.2 X1.15
RDS_INT  (via drill 0.6)
  Top 1.27: v72.7,28.57 70,31.27 IC1.33
  Bottom 0.813: X1.14 72.7,26.66 | X1.14 | 72.7,26.66 R5.1 | 72.7,26.66 v72.7,28.57
RIGHT
  Bottom 1.93: X4.2 15.38,26.49 R12.1 | R12.1 | R12.1 C14.2
RS_LCD
  Bottom 0.813: LCD1.4 36.19,69.37 38.25,71.43 71.43,71.43 73.18,69.68 73.18,55.87 70,52.7 70,49.84
  Bottom 1.27: 70,49.84 | 70,49.84 IC1.8
RW_LCD
  Bottom 0.813: LCD1.5 38.73,69.21 39.68,70.16 70.16,70.16 71.59,68.73 71.59,56.51 67.46,52.38 IC1.9 | IC1.9
SCL  (via drill 0.6)
  Top 0.61: 61.11,38.57 61.11,32.54 68.1,25.55 83.97,25.55 86.36,23.17 v86.67,22.85
  Top 1.27: IC1.18 44.6,46.19 47.3,43.49 56.19,43.49 61.11,38.57
  Bottom 0.813: X1.3 | X1.3
  Bottom 1.27: v86.67,22.85 X1.3
SDI  (via drill 0.6)
  Top 0.61: v85.4,13.33 84.45,13.33 49.84,13.33 v44.6,18.57
  Bottom 0.61: IC1.23
  Bottom 1.016: v44.6,18.57 IC1.23
  Bottom 1.27: X1.4 85.4,13.8 v85.4,13.33
SDO  (via drill 0.6)
  Top 0.61: v47.14,18.57 50.79,14.92 86.36,14.92 v87.94,13.33
  Bottom 1.016: X1.2 | X1.2 | IC1.24 47.14,19.84 v47.14,18.57
  Bottom 1.27: v87.94,13.33 X1.2
TEST  (via drill 0.6)
  Top 1.016: SJ1.2 v73.97,20.95
  Bottom 1.27: X1.13 73.97,20 v73.97,20.95
VCC  (via drill 0.6)
  Top 0.813: v41.9,31.74 41.9,25.71 41.9,15.87 40.48,14.44 23.81,14.44 20.16,10.79 20.16,3.33 R14.2
  Top 1.27: v85.88,45.08 81.43,45.08 63.81,45.08 62.38,46.51 62.38,49.68 | 62.38,49.68 | 62.38,49.68 IC1.11 62.38,51.59 64.93,54.13 R40.1 | C6.1 38.73,25.71 | 38.73,25.71 41.9,25.71 IC2.4 | IC2.4 | IC2.2 38.73,25.69 38.73,25.71
  Bottom 0.813: C3.1 | IC1.11 62.38,46.03 C3.1 | C3.1 | C3.1 62.38,45.71 62.38,42.7 67.46,37.62 IC1.32 | C3.1 62.38,45.87 | 62.38,45.87 | 62.38,45.87 62.38,43.81 | v41.9,31.74 41.43,31.74 41.43,31.58 41.59,31.74 | v41.9,31.74 42.54,31.74 43.33,32.54 43.33,36.35 43.81,36.82 55.4,36.82 56.03,36.19 56.03,32.54 56.83,31.74 61.43,31.74 62.54,31.74 63.18,31.74 66.99,31.74 67.46,32.22 IC1.32 | IC1.32 | v41.9,31.74 40,31.74 | 40,31.74
  Bottom 1.27: 41.59,31.74 40,31.74 37.62,31.74 32.38,36.98 32.38,40.47 20.95,51.9 10.95,51.9 10,52.86 10,59.37 10.95,60.32 14.92,60.32
  Bottom 1.422: 38.89,4.6 25.71,4.6 25.39,4.6 22.7,4.6 21.74,3.65 R14.2 | 38.89,4.6 39.05,4.6 | 39.05,4.6 39.21,4.44 R17.2 | R17.2 39.21,4.28 38.89,4.6 | 39.21,4.6 39.05,4.6 | 39.21,4.6 61.27,4.6 | 61.27,4.6 R18.2 | R17.2 | 39.21,4.6 R17.2 | 61.27,4.6 90.32,4.6 90.96,3.96 R19.2 R20.2 | R20.2
  Bottom 1.676: ICD2.2 98.1,46.35 96.83,45.08 v85.88,45.08
  Bottom 1.778: LCD1.2 31.11,63.33 28.09,60.32 14.92,60.32 R1.A
  pour Top (isolate 0.305, no thermals): 34.6,33.97 59.05,33.97 59.05,16.82 34.6,16.82